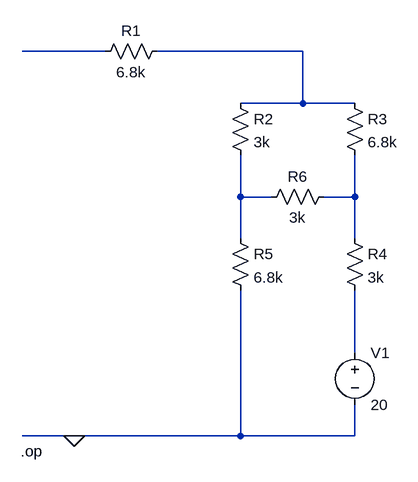
[diagram p0: schematic circuitlab.asc]
circuitlab.asc, the LTspice schematic file:
Version 4
SHEET 1 880 780
WIRE 64 144 -64 144
WIRE 368 144 144 144
WIRE 368 224 368 144
WIRE 368 224 272 224
WIRE 448 224 368 224
WIRE 272 368 272 304
WIRE 320 368 272 368
WIRE 448 368 448 304
WIRE 448 368 400 368
WIRE 272 432 272 368
WIRE 448 432 448 368
WIRE 448 608 448 512
WIRE 16 736 -64 736
WIRE 272 736 272 512
WIRE 272 736 16 736
WIRE 448 736 448 688
WIRE 448 736 272 736
FLAG 16 736 0
DATAFLAG 0 144 ""
DATAFLAG -48 736 ""
SYMBOL res 160 128 R90
WINDOW 0 0 56 VBottom 2
WINDOW 3 32 56 VTop 2
SYMATTR InstName R1
SYMATTR Value 6.8k
SYMBOL res 256 208 R0
SYMATTR InstName R2
SYMATTR Value 3k
SYMBOL res 432 208 R0
SYMATTR InstName R3
SYMATTR Value 6.8k
SYMBOL res 432 416 R0
SYMATTR InstName R4
SYMATTR Value 3k
SYMBOL res 256 416 R0
SYMATTR InstName R5
SYMATTR Value 6.8k
SYMBOL res 416 352 R90
WINDOW 0 0 56 VBottom 2
WINDOW 3 32 56 VTop 2
SYMATTR InstName R6
SYMATTR Value 3k
SYMBOL voltage 448 592 R0
SYMATTR InstName V1
SYMATTR Value 20
TEXT -66 760 Left 2 !.op

The netlist it stands for:
* circuitlab.asc
R1 N002 N001 6.8k
R2 N002 N003 3k
R3 N002 N004 6.8k
R4 N004 N005 3k
R5 N003 0 6.8k
R6 N004 N003 3k
V1 N005 0 20
.op
.backanno
.end